# EAGLE schematic wearcast_clock (EAGLE 7.4.0)
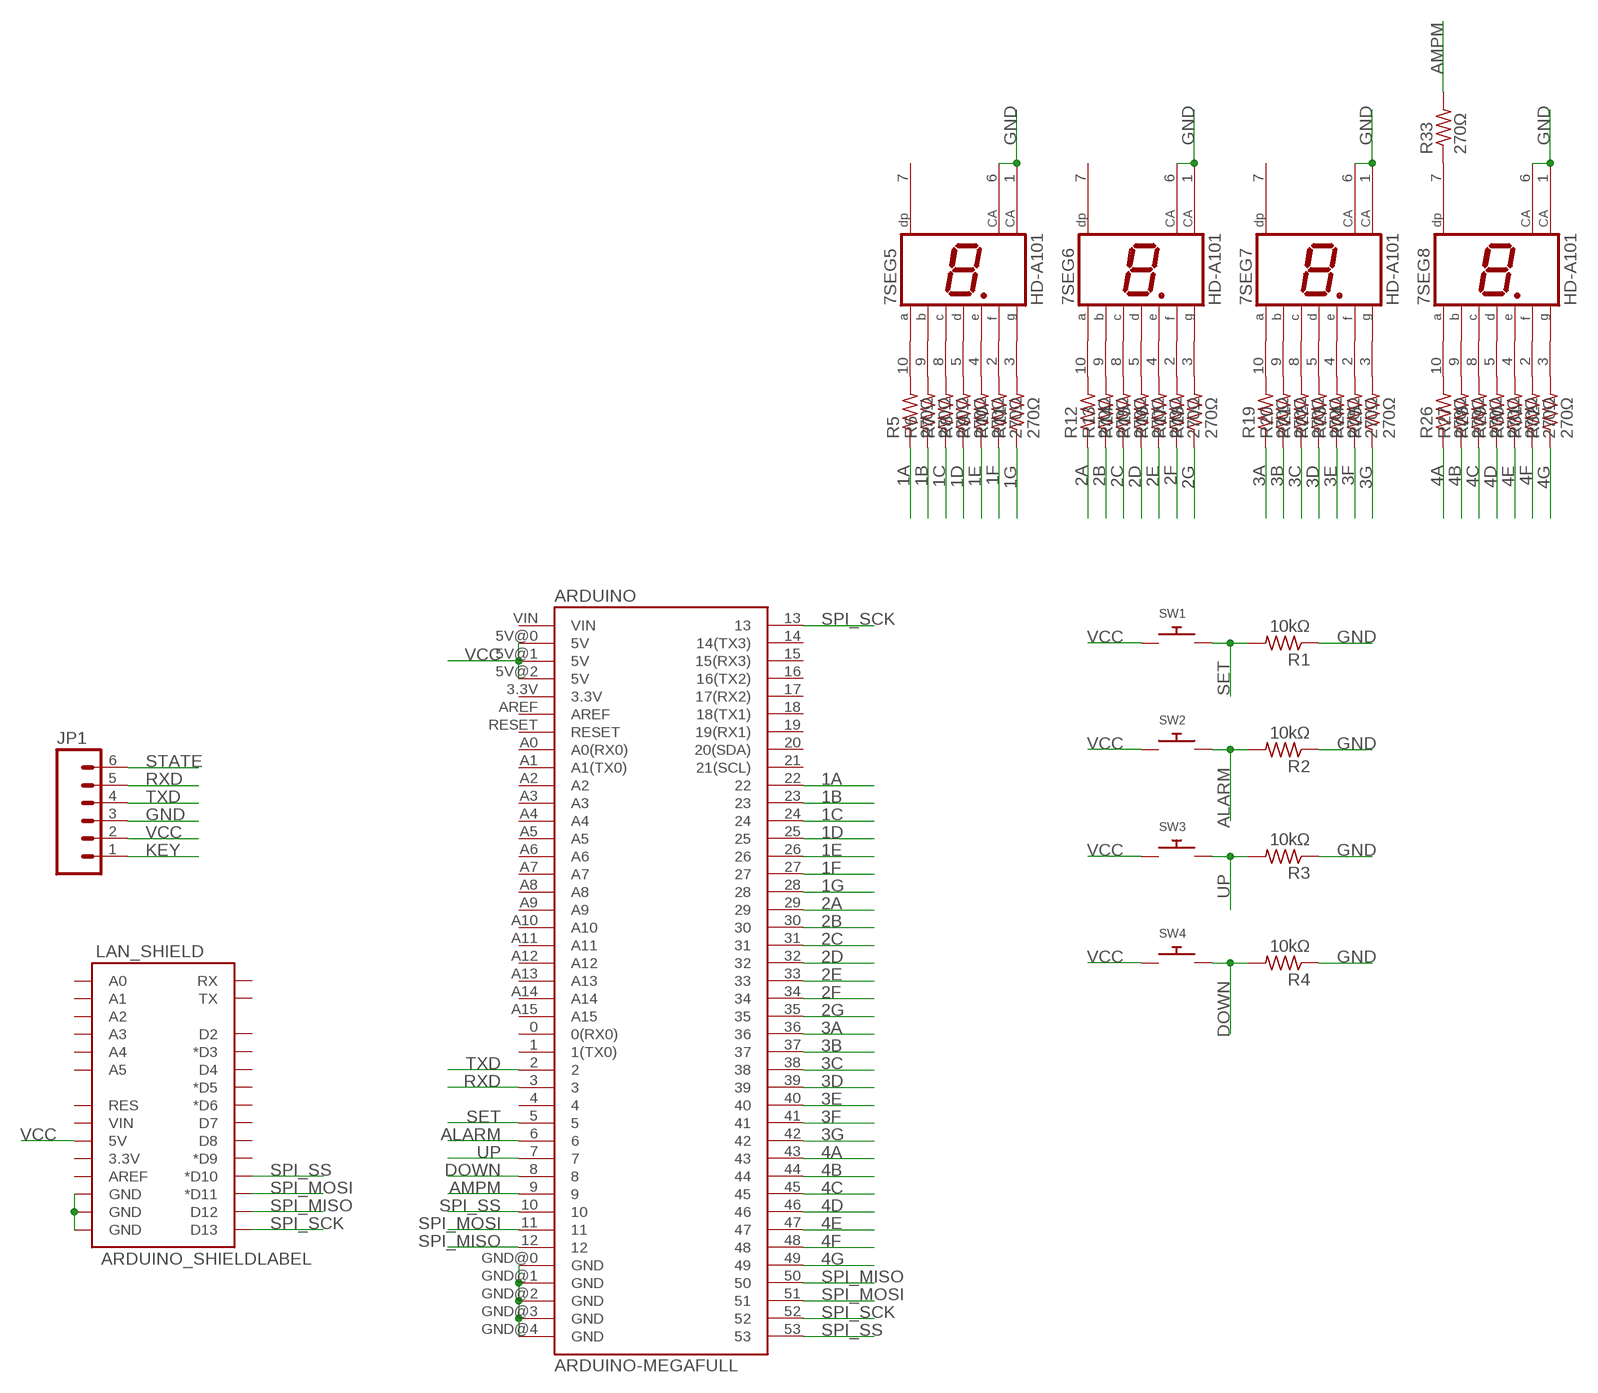
[diagram p0: schematic, sheet 1]

## Parts
7SEG5  HD-A101  [HDSP-A]
7SEG6  HD-A101  [HDSP-A]
7SEG7  HD-A101  [HDSP-A]
7SEG8  HD-A101  [HDSP-A]
ARDUINO  ARDUINO-MEGAFULL  [ARDUINO_MEGA]
JP1  M06SILK_FEMALE_PTH  [1X06]
LAN_SHIELD  ARDUINO_SHIELDLABEL  [DUEMILANOVE_SHIELD]
R1  10kΩ  R-US_0204/7  [0204/7]
R2  10kΩ  R-US_0204/7  [0204/7]
R3  10kΩ  R-US_0204/7  [0204/7]
R4  10kΩ  R-US_0204/7  [0204/7]
R5  270Ω  R-US_0204/7  [0204/7]
R6  270Ω  R-US_0204/7  [0204/7]
R7  270Ω  R-US_0204/7  [0204/7]
R8  270Ω  R-US_0204/7  [0204/7]
R9  270Ω  R-US_0204/7  [0204/7]
R10  270Ω  R-US_0204/7  [0204/7]
R11  270Ω  R-US_0204/7  [0204/7]
R12  270Ω  R-US_0204/7  [0204/7]
R13  270Ω  R-US_0204/7  [0204/7]
R14  270Ω  R-US_0204/7  [0204/7]
R15  270Ω  R-US_0204/7  [0204/7]
R16  270Ω  R-US_0204/7  [0204/7]
R17  270Ω  R-US_0204/7  [0204/7]
R18  270Ω  R-US_0204/7  [0204/7]
R19  270Ω  R-US_0204/7  [0204/7]
R20  270Ω  R-US_0204/7  [0204/7]
R21  270Ω  R-US_0204/7  [0204/7]
R22  270Ω  R-US_0204/7  [0204/7]
R23  270Ω  R-US_0204/7  [0204/7]
R24  270Ω  R-US_0204/7  [0204/7]
R25  270Ω  R-US_0204/7  [0204/7]
R26  270Ω  R-US_0204/7  [0204/7]
R27  270Ω  R-US_0204/7  [0204/7]
R28  270Ω  R-US_0204/7  [0204/7]
R29  270Ω  R-US_0204/7  [0204/7]
R30  270Ω  R-US_0204/7  [0204/7]
R31  270Ω  R-US_0204/7  [0204/7]
R32  270Ω  R-US_0204/7  [0204/7]
R33  270Ω  R-US_0204/7  [0204/7]
SW1  SWITCH_PUSHBUTTONEVQ-PE  [TACT_PANA-EVQ]
SW2  SWITCH_PUSHBUTTONEVQ-PE  [TACT_PANA-EVQ]
SW3  SWITCH_PUSHBUTTONEVQ-PE  [TACT_PANA-EVQ]
SW4  SWITCH_PUSHBUTTONEVQ-PE  [TACT_PANA-EVQ]

## Nets
1A: R5.1
1B: R6.1
1C: R7.1
1D: R8.1
1E: R9.1
1F: R10.1
1G: R11.1
2A: R12.1
2B: R13.1
2C: R14.1
2D: R15.1
2E: R16.1
2F: R17.1
2G: R18.1
3A: R19.1
3B: R20.1
3C: R21.1
3D: R22.1
3E: R23.1
3F: R24.1
3G: R25.1
4A: R26.1
4B: R27.1
4C: R28.1
4D: R29.1
4E: R30.1
4F: R31.1
4G: R32.1
ALARM: ARDUINO.6 R2.2 SW2.P$2
AMPM: ARDUINO.9 R33.2
DOWN: ARDUINO.8 R4.2 SW4.P$2
GND: 7SEG5.1(CA) 7SEG5.6(CA) 7SEG6.1(CA) 7SEG6.6(CA) 7SEG7.1(CA) 7SEG7.6(CA) 7SEG8.1(CA) 7SEG8.6(CA) JP1.3 R1.1 R2.1 R3.1 R4.1
KEY: JP1.1
N$2: ARDUINO.GND@0(GND) ARDUINO.GND@1(GND) ARDUINO.GND@2(GND) ARDUINO.GND@3(GND) ARDUINO.GND@4(GND)
N$5: 7SEG5.10(A) R5.2
N$7: 7SEG5.9(B) R6.2
N$8: LAN_SHIELD.GND@0(GND) LAN_SHIELD.GND@1(GND) LAN_SHIELD.GND@2(GND)
N$11: 7SEG5.8(C) R7.2
N$13: 7SEG5.2(F) R10.2
N$14: 7SEG5.3(G) R11.2
N$15: 7SEG8.7(DP) R33.1
N$16: 7SEG5.5(D) R8.2
N$17: 7SEG5.4(E) R9.2
N$18: 7SEG6.10(A) R12.2
N$19: 7SEG6.9(B) R13.2
N$20: 7SEG6.8(C) R14.2
N$21: 7SEG6.5(D) R15.2
N$22: 7SEG6.4(E) R16.2
N$23: 7SEG6.2(F) R17.2
N$24: 7SEG6.3(G) R18.2
N$25: 7SEG7.10(A) R19.2
N$26: 7SEG7.9(B) R20.2
N$27: 7SEG7.8(C) R21.2
N$28: 7SEG7.5(D) R22.2
N$29: 7SEG7.4(E) R23.2
N$30: 7SEG7.2(F) R24.2
N$31: 7SEG7.3(G) R25.2
N$32: 7SEG8.10(A) R26.2
N$33: 7SEG8.9(B) R27.2
N$34: 7SEG8.8(C) R28.2
N$35: 7SEG8.5(D) R29.2
N$36: 7SEG8.4(E) R30.2
N$37: 7SEG8.2(F) R31.2
N$38: 7SEG8.3(G) R32.2
RXD: ARDUINO.3 JP1.5
SET: R1.2 SW1.P$2
SPI_MISO: ARDUINO.12
SPI_MOSI: ARDUINO.11 ARDUINO.51
SPI_SCK: ARDUINO.13 ARDUINO.52
SPI_SS: ARDUINO.10 ARDUINO.53
STATE: JP1.6
TXD: ARDUINO.2 JP1.4
UP: ARDUINO.7 R3.2 SW3.P$2
VCC: ARDUINO.5V@0(5V) ARDUINO.5V@1(5V) ARDUINO.5V@2(5V) JP1.2 LAN_SHIELD.5V SW1.P$1 SW2.P$1 SW3.P$1 SW4.P$1
Unconnected: 7SEG5.7(DP) 7SEG6.7(DP) 7SEG7.7(DP) ARDUINO.0(0(RX0)) ARDUINO.1(1(TX0)) ARDUINO.3.3V ARDUINO.4 ARDUINO.5 ARDUINO.14(14(TX3)) ARDUINO.15(15(RX3)) ARDUINO.16(16(TX2)) ARDUINO.17(17(RX2)) ARDUINO.18(18(TX1)) ARDUINO.19(19(RX1)) ARDUINO.20(20(SDA)) ARDUINO.21(21(SCL)) ARDUINO.22 ARDUINO.23 ARDUINO.24 ARDUINO.25 ARDUINO.26 ARDUINO.27 ARDUINO.28 ARDUINO.29 ARDUINO.30 ARDUINO.31 ARDUINO.32 ARDUINO.33 ARDUINO.34 ARDUINO.35 ARDUINO.36 ARDUINO.37 ARDUINO.38 ARDUINO.39 ARDUINO.40 ARDUINO.41 ARDUINO.42 ARDUINO.43 ARDUINO.44 ARDUINO.45 ARDUINO.46 ARDUINO.47 ARDUINO.48 ARDUINO.49 ARDUINO.50 ARDUINO.A0(A0(RX0)) ARDUINO.A1(A1(TX0)) ARDUINO.A2 ARDUINO.A3 ARDUINO.A4 ARDUINO.A5 ARDUINO.A6 ARDUINO.A7 ARDUINO.A8 ARDUINO.A9 ARDUINO.A10 ARDUINO.A11 ARDUINO.A12 ARDUINO.A13 ARDUINO.A14 ARDUINO.A15 ARDUINO.AREF ARDUINO.RESET ARDUINO.VIN LAN_SHIELD.3.3V LAN_SHIELD.A0 LAN_SHIELD.A1 LAN_SHIELD.A2 LAN_SHIELD.A3 LAN_SHIELD.A4 LAN_SHIELD.A5 LAN_SHIELD.AREF LAN_SHIELD.D2 LAN_SHIELD.D3(*D3) LAN_SHIELD.D4 LAN_SHIELD.D5(*D5) LAN_SHIELD.D6(*D6) LAN_SHIELD.D7 LAN_SHIELD.D8 LAN_SHIELD.D9(*D9) LAN_SHIELD.D10(*D10) LAN_SHIELD.D11(*D11) LAN_SHIELD.D12 LAN_SHIELD.D13 LAN_SHIELD.RES LAN_SHIELD.RX LAN_SHIELD.TX LAN_SHIELD.VIN

## Library data of the parts
7SEG5-7SEG8 = display-hp:HD-A101: LED DISPLAY 1-character 7 segment, decimal point right; OC_FARNELL: unknown; OC_NEWARK: unknown
ARDUINO = SparkFun-Boards:ARDUINO-MEGA: Arduino Mega board footprint
JP1 = SparkFun-Connectors:M06: Header 6 Standard 6-pin 0.1" header. Use with straight break away headers (SKU : PRT-00116), right angle break away headers (PRT-00553), swiss pins (PRT-00743), machine pins (PRT-00117), and female headers (PRT-00115). Molex polarized connector foot print use with SKU : PRT-08094 with associated crimp pins and housings. NOTES ON THE VARIANTS LOCK and LOCK_LONGPADS... This footprint was designed to help hold the alignment of a through-hole component (i.e. 6-pin header) while soldering it into place. You may notice that each hole has been shifted either up or down by 0.005 of an inch from it's more standard position (which is a perfectly straight line). This slight alteration caused the pins (the squares in the middle) to touch the edges of the holes. Because they are alternating, it causes a "brace" to hold the component in place. 0.005 has proven to be the perfect amount of "off-center" position when using our standard breakaway headers. Although looks a little odd when you look at the bare footprint, once you have a header in there, the alteration is very hard to notice. Also,if you push a header all the way into place, it is covered up entirely on the bottom side. This idea of altering the position of holes to aid alignment will be further integrated into the Sparkfun Library for other footprints. It can help hold any component with 3 or more connection pins.; PROD_ID: CONN-08437
LAN_SHIELD = SparkFun-Boards:ARDUINO_SHIELD: Arduino shield footprint
R1-R33 = resistor:R-US_: RESISTOR, American symbol
SW1-SW4 = adafruit:SWITCH_PUSHBUTTON: Buttons SOFTTOUCHSMD_SJ - Soft touch temporary push button (Super Junk Akihabara) Compatible with SKPMANE010 [Mouser: 688-SKPMAN] C&K_KSS = Digikey: KSS221GLFS